# EAGLE design 7_segment (EAGLE 5.11)
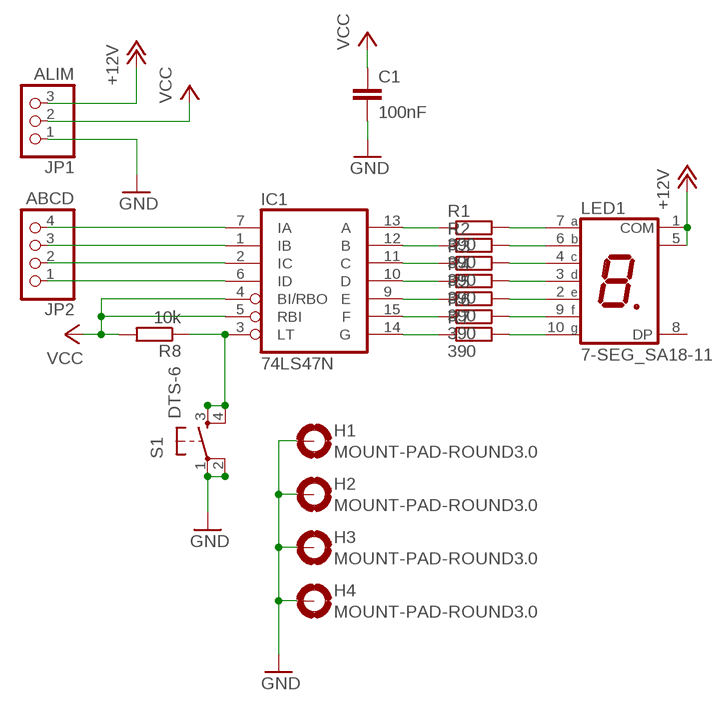
[diagram p0: schematic, sheet 1]

## Parts
C1  100nF  C-EU025-050X050  [C025-050X050]
H1  MOUNT-PAD-ROUND3.0  [3,0-PAD]
H2  MOUNT-PAD-ROUND3.0  [3,0-PAD]
H3  MOUNT-PAD-ROUND3.0  [3,0-PAD]
H4  MOUNT-PAD-ROUND3.0  [3,0-PAD]
IC1  74LS47N  [DIL16]
JP1  ALIM  PINHD-1X3  [1X03]
JP2  ABCD  PINHD-1X4  [1X04]
LED1  7-SEG_SA18-11  [SA18-11]
R1  390  R-EU_0207/10  [0207/10]
R2  390  R-EU_0207/10  [0207/10]
R3  390  R-EU_0207/10  [0207/10]
R4  390  R-EU_0207/10  [0207/10]
R5  390  R-EU_0207/10  [0207/10]
R6  390  R-EU_0207/10  [0207/10]
R7  390  R-EU_0207/10  [0207/10]
R8  10k  R-EU_0207/10  [0207/10]
S1  DTS-6  [DTS-6]

## Nets
+12V: JP1.3 LED1.1(COM) LED1.5(COM)
GND [alim]: C1.2 H1.B3,0(MOUNT) H2.B3,0(MOUNT) H3.B3,0(MOUNT) H4.B3,0(MOUNT) JP1.1 S1.1 S1.2
N$1 [led]: IC1.13(A) R1.1
N$2 [led]: IC1.12(B) R2.1
N$3 [led]: IC1.11(C) R3.1
N$4 [led]: IC1.10(D) R4.1
N$5 [led]: IC1.9(E) R5.1
N$6 [led]: IC1.15(F) R6.1
N$7 [led]: IC1.14(G) R7.1
N$8 [led]: LED1.7(A) R1.2
N$9 [led]: LED1.6(B) R2.2
N$10 [led]: LED1.4(C) R3.2
N$11 [led]: LED1.3(D) R4.2
N$12 [led]: LED1.2(E) R5.2
N$13 [led]: LED1.9(F) R6.2
N$14 [led]: LED1.10(G) R7.2
N$15: IC1.7(IA) JP2.4
N$16: IC1.1(IB) JP2.3
N$17: IC1.2(IC) JP2.2
N$18: IC1.6(ID) JP2.1
N$21: IC1.3(LT) R8.1 S1.3 S1.4
VCC: C1.1 IC1.4(BI/RBO) IC1.5(RBI) JP1.2 R8.2
Unconnected: LED1.8(DP)

## Power pins joined to a net without a drawn wire
GND: IC1.8(GND)
VCC: IC1.16(VCC)

## Library data of the parts
C1 = resistor:C-EU: CAPACITOR, European symbol
H1-H4 = holes:MOUNT-PAD-ROUND: MOUNTING PAD, round
IC1 = 74xx-eu:74*47: BCD to seven segment DECODER/DRIVER Source: http://www.ee.washington.edu/stores/DataSheets/74ls/74ls47.pdf
JP1 = pinhead:PINHD-1X3: PIN HEADER
JP2 = pinhead:PINHD-1X4: PIN HEADER
LED1 = display-kingbright_fix:7-SEG_: Kingbright 14.2mm (0.56 INCH) SINGLE DIGIT NUMERIC DUISPLAY Source: SA56-11EWA(Ver1189471036.pdf; OC_FARNELL: unknown; OC_NEWARK: unknown
R1-R8 = resistor:R-EU_: RESISTOR, European symbol
S1 = switch-tact:DTS-6

## Net classes
0 default: width 0.813 mm
1 alim: width 1.27 mm
2 led: width 1.016 mm

## Board
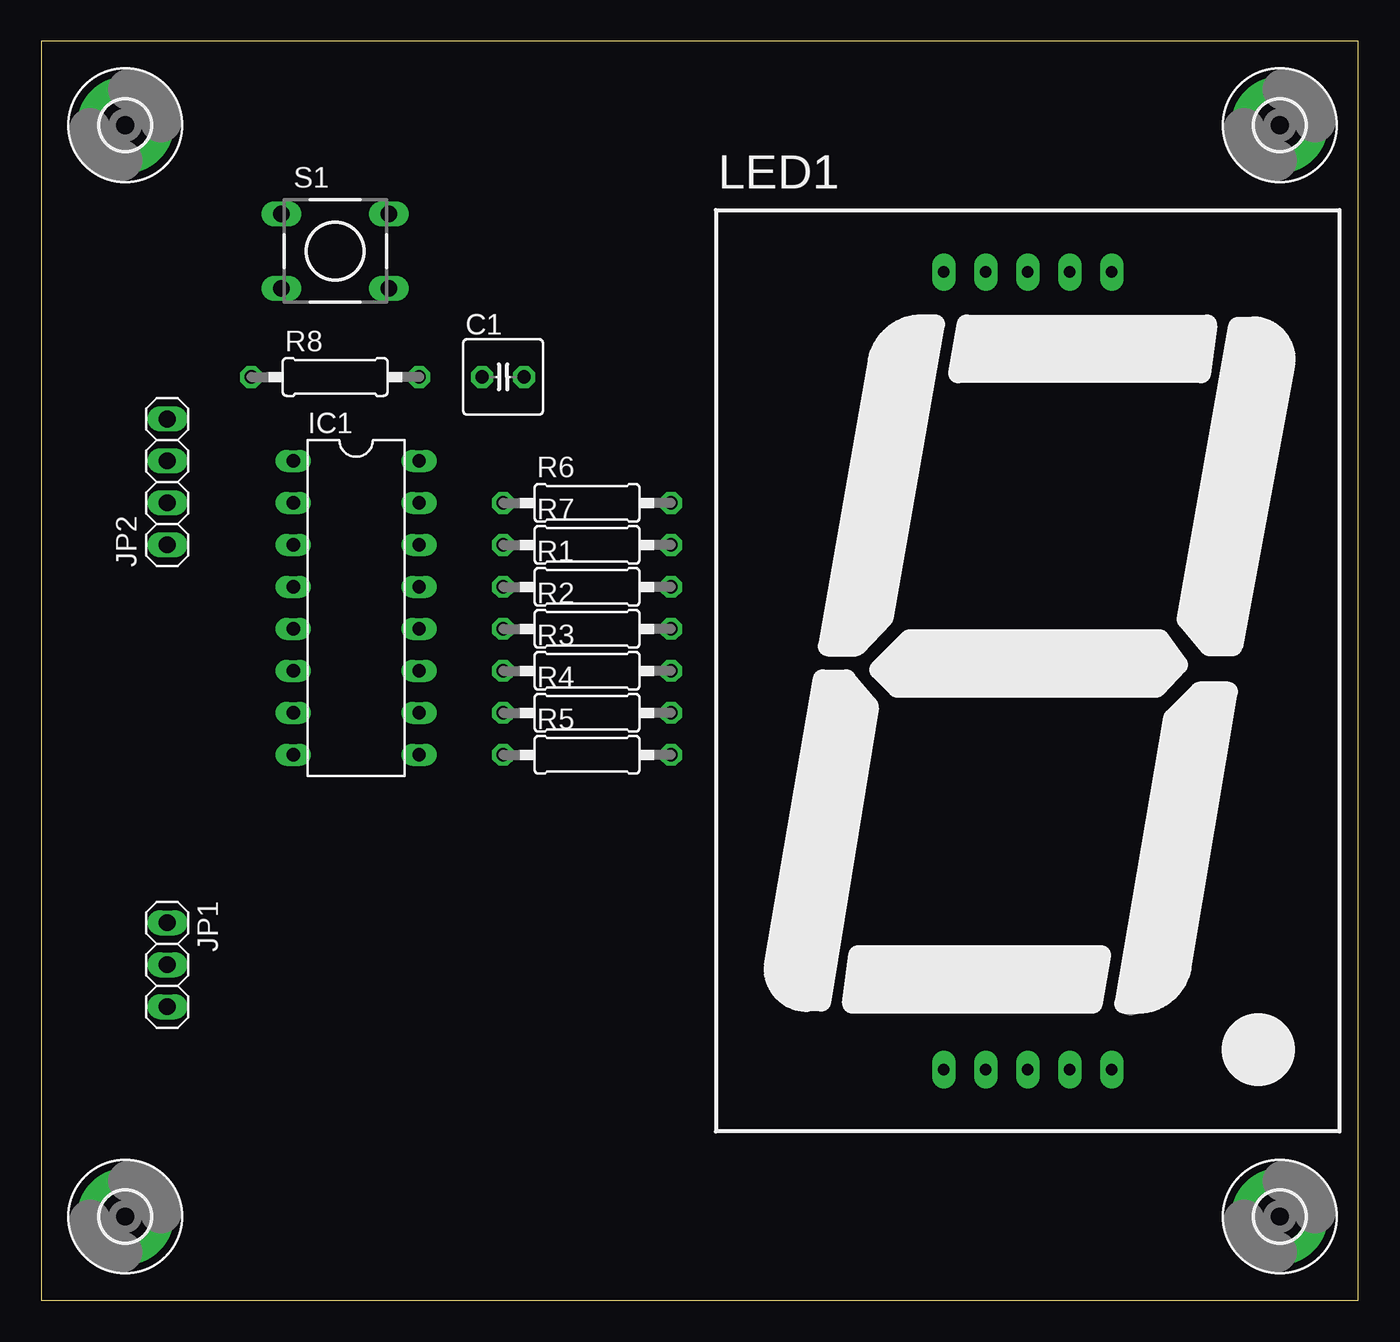
[diagram p1: board, top side]
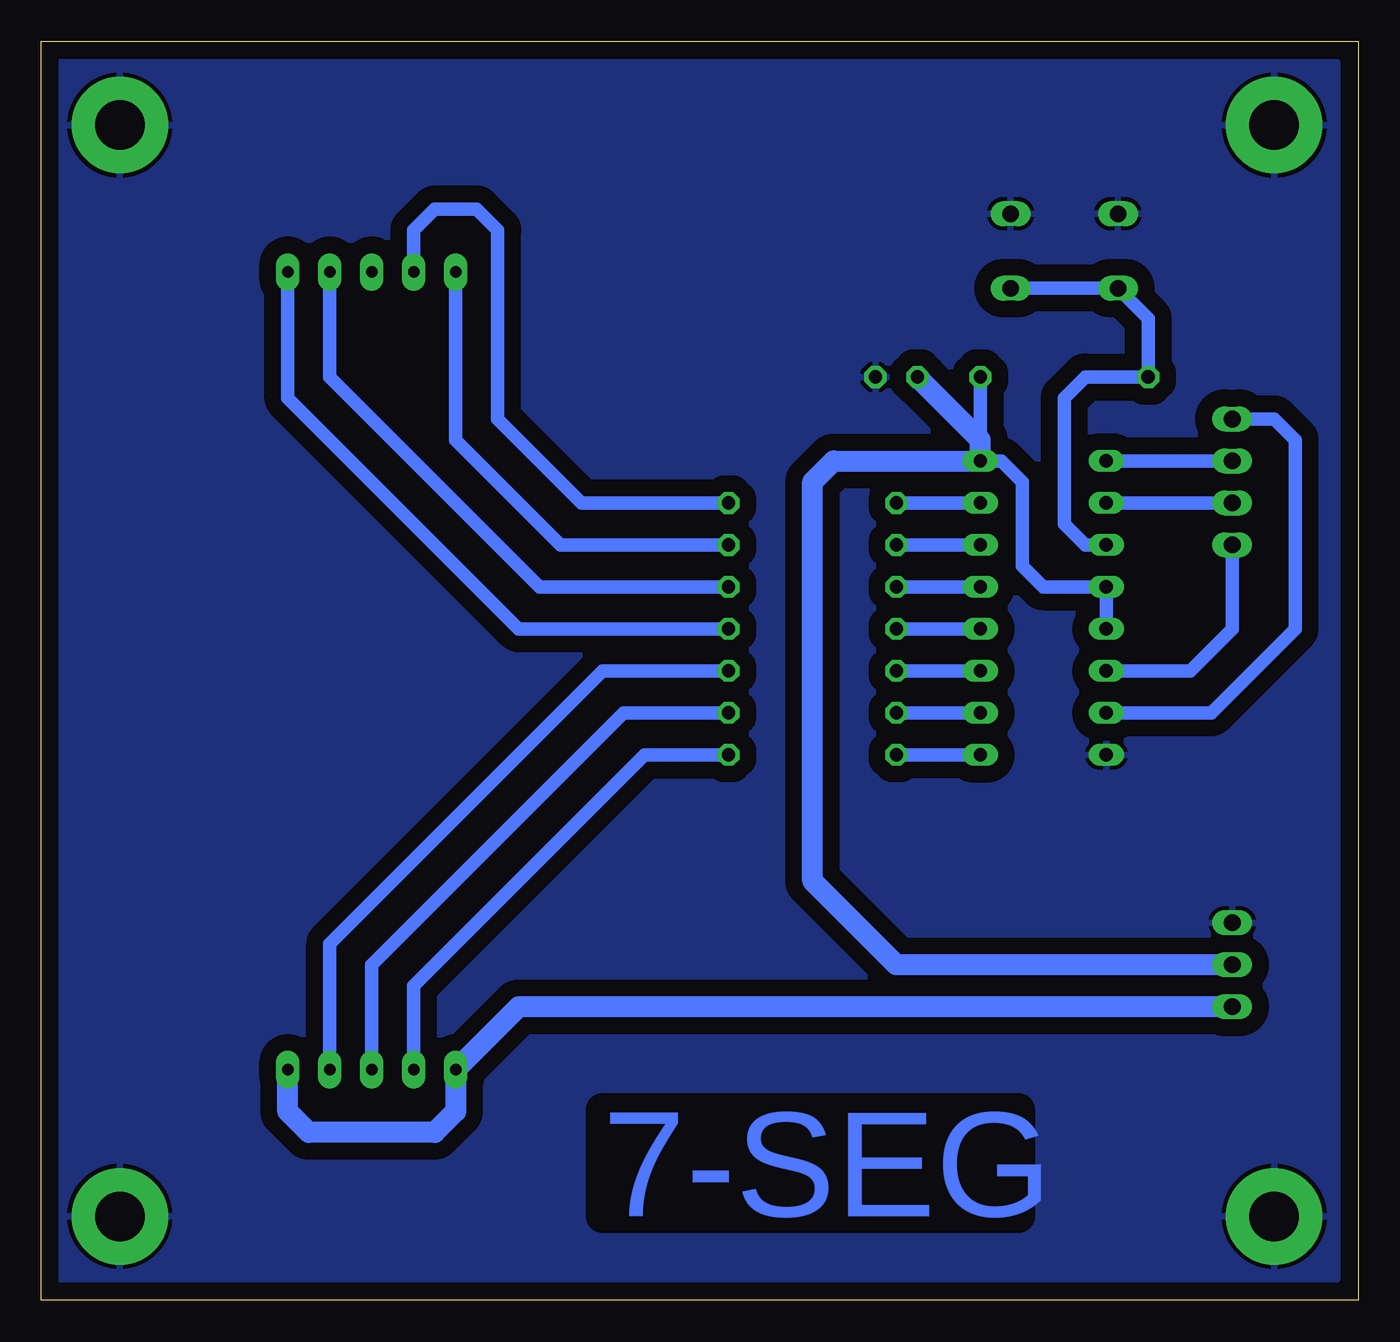
[diagram p2: board, bottom side, seen from below]

Size 79.68 x 76.19 mm. Coordinates in mm from the lower left corner, seen from the top.
Outline: 0,0 79.68,0 79.68,76.19 0,76.19 0,0
Copper layers (1*16): Top 0.035mm / dielectric 1.5mm / Bottom 0.035mm
Design rules "default *": minimum track width 32mil, minimum drill 24mil, track to track 8mil, track to pad 8mil, pad to pad 8mil, via to via 8mil, smd to smd 8mil, copper to edge 40mil, drill to drill 8mil, minimum pad ring 10mil, minimum via ring 8mil, stop-mask expansion 4mil, vias tented up to drill 0mil, thermal gap 10mil

### Footprints (pad centres in the part's own frame; a part is rotated, then mirrored left to right if it is on the bottom)
C025-050X050 = drill 0.813 octagon: 1 -1.27,0; 2 1.27,0
3,0-PAD = drill 3 pad 5.842 round: B3,0 0,0
DIL16 = drill 0.813 long: 1 -8.89,-3.81; 2 -6.35,-3.81; 3 -3.81,-3.81; 4 -1.27,-3.81; 5 1.27,-3.81; 6 3.81,-3.81; 7 6.35,-3.81; 8 8.89,-3.81; 9 8.89,3.81; 10 6.35,3.81; 11 3.81,3.81; 12 1.27,3.81; 13 -1.27,3.81; 14 -3.81,3.81; 15 -6.35,3.81; 16 -8.89,3.81
1X03 = drill 1.016 long: 1 -2.54,0; 2 0,0; 3 2.54,0
1X04 = drill 1.016 long: 1 -3.81,0; 2 -1.27,0; 3 1.27,0; 4 3.81,0
SA18-11 = drill 0.7 pad 1.422 long: 1 -5.08,-24.13; 2 -2.54,-24.13; 3 0,-24.13; 4 2.54,-24.13; 5 5.08,-24.13; 6 5.08,24.13; 7 2.54,24.13; 8 0,24.13; 9 -2.54,24.13; 10 -5.08,24.13
0207/10 = drill 0.813 octagon: 1 -5.08,0; 2 5.08,0
DTS-6 = drill 1 long: 1 -3.25,2.25; 2 3.25,2.25; 3 -3.25,-2.25; 4 3.25,-2.25

### Placement (x,y rotation side)
C1  27.94,55.88 0 top
H1  5.08,5.08 0 top
H2  74.93,71.12 0 top
H3  74.93,5.08 0 top
H4  5.08,71.12 0 top
IC1  19.05,41.91 270 top
JP1  7.62,20.32 270 top
JP2  7.62,49.53 90 top
LED1  59.69,38.1 0 top
R1  33.02,43.18 0 top
R2  33.02,40.64 0 top
R3  33.02,38.1 0 top
R4  33.02,35.56 0 top
R5  33.02,33.02 0 top
R6  33.02,48.26 0 top
R7  33.02,45.72 0 top
R8  17.78,55.88 0 top
S1  17.78,63.5 0 top

### Tracks (layer width: path | path; a pad name or v marks a point on that pad's centre or on a via)
+12V
  Bottom 1.27: LED1.5 64.77,11.43 63.5,10.16 55.88,10.16 54.61,11.43 LED1.1 50.8,17.78 JP1.3
GND
  pour Bottom (isolate 1.016): 1.27,1.27 1.27,74.93 78.74,74.93 78.74,1.27
N$1
  Bottom 0.813: IC1.13 R1.1
N$2
  Bottom 0.813: IC1.12 R2.1
N$3
  Bottom 0.813: IC1.11 R3.1
N$4
  Bottom 0.813: IC1.10 R4.1
N$5
  Bottom 0.813: IC1.9 R5.1
N$6
  Bottom 0.813: IC1.15 R6.1
N$7
  Bottom 0.813: IC1.14 R7.1
N$8
  Bottom 0.813: R1.2 49.53,43.18 62.23,55.88 LED1.7
N$9
  Bottom 0.813: R2.2 50.8,40.64 64.77,54.61 LED1.6
N$10
  Bottom 0.813: R3.2 45.72,38.1 62.23,21.59 LED1.4
N$11
  Bottom 0.813: R4.2 44.45,35.56 59.69,20.32 LED1.3
N$12
  Bottom 0.813: R5.2 43.18,33.02 57.15,19.05 LED1.2
N$13
  Bottom 0.813: R6.2 46.99,48.26 52.07,53.34 52.07,64.77 53.34,66.04 55.88,66.04 57.15,64.77 LED1.9
N$14
  Bottom 0.813: R7.2 48.26,45.72 54.61,52.07 LED1.10
N$15
  Bottom 0.813: IC1.7 8.89,35.56 3.81,40.64 3.81,52.07 5.08,53.34 JP2.4
N$16
  Bottom 0.813: JP2.3 IC1.1
N$17
  Bottom 0.813: JP2.2 IC1.2
N$18
  Bottom 0.813: IC1.6 10.16,38.1 7.62,40.64 JP2.1
N$21
  Bottom 0.813: S1.4 S1.3 12.7,59.42 R8.1 16.51,55.88 17.78,54.61 17.78,46.99 16.51,45.72 IC1.3
VCC
  Bottom 0.813: R8.2 IC1.16 21.59,50.8 20.32,49.53 20.32,44.45 19.05,43.18 IC1.4 IC1.5
  Bottom 1.27: JP1.2 27.94,20.32 33.02,25.4 33.02,49.53 31.75,50.8 IC1.16 22.86,52.07 C1.1

### Text on the board
Bottom: 7-SEG